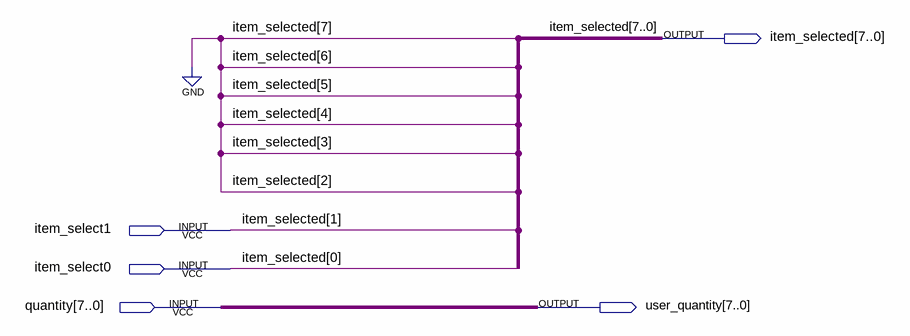
[diagram p0: schematic sheet]
// Quartus schematic buy_menu.bdf as structural Verilog: 0 symbols, 5 pins
module buy_menu (
  input  item_select1,
  input  item_select0,
  input  [7:0] quantity,
  output [7:0] item_selected,
  output [7:0] user_quantity
);


  assign item_selected = {{6{1'b0}}, item_select1, item_select0};
  assign user_quantity = quantity;
endmodule
